# EAGLE design WeMos-meteo_v1.1 (EAGLE 9.2.2)
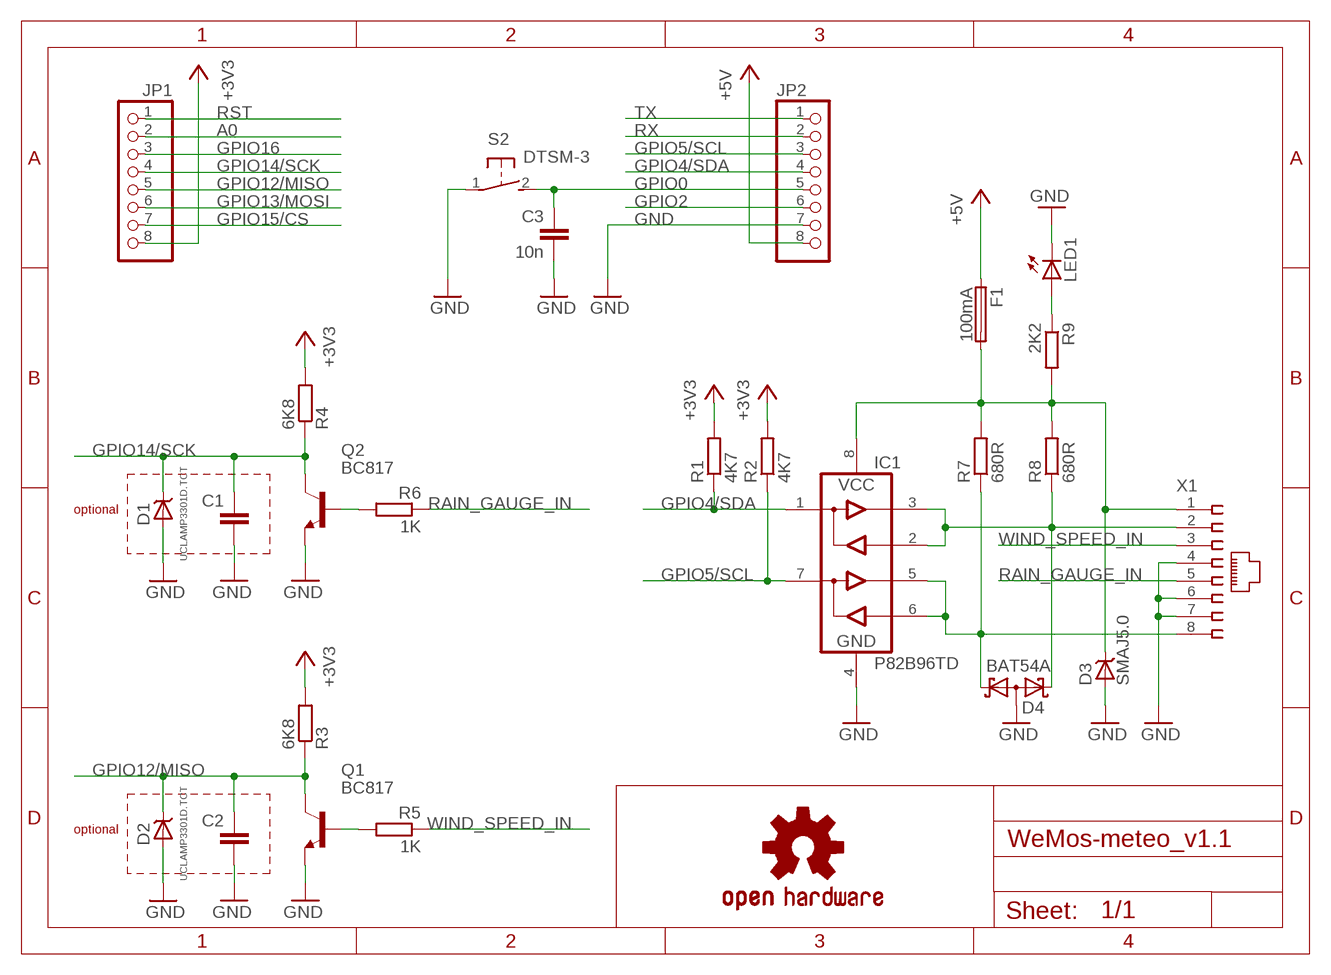
[diagram p0: schematic, sheet 1]

## Parts
C1  C-EUC0805  [C0805]
C2  C-EUC0805  [C0805]
C3  10n  C-EUC0805  [C0805]
D1  UCLAMP3301D.TCT  [SOD323]
D2  UCLAMP3301D.TCT  [SOD323]
D3  SMAJ5.0  [DO214AC]
D4  BAT54A  [SOT23]
F1  100mA  19560  [19560]
IC1  P82B96TD  [SO08]
JP1  PINHD-1X08_2.54-S  [1X08-S]
JP2  PINHD-1X08_2.54-S  [1X08-S]
LED1  LED0805  [LED0805]
LOGO1  OSHW-LOGOMINI  [OSHW-LOGO-MINI]
Q1  BC817  BC817-40SMD  [SOT23-BEC]
Q2  BC817  BC817-40SMD  [SOT23-BEC]
R1  4K7  R-EU_R0805  [R0805]
R2  4K7  R-EU_R0805  [R0805]
R3  6K8  R-EU_R0805  [R0805]
R4  6K8  R-EU_R0805  [R0805]
R5  1K  R-EU_R0805  [R0805]
R6  1K  R-EU_R0805  [R0805]
R7  680R  R-EU_R0805  [R0805]
R8  680R  R-EU_R0805  [R0805]
R9  2K2  R-EU_R0805  [R0805]
S2  DTSM-3  [DTSM-3]
X1  RJ-45  [95501]

## Nets
+3V3: JP1.8 R1.2 R2.2 R3.2 R4.2
+5V: F1.1 JP2.8
A0: JP1.2
GND: C1.2 C2.2 C3.2 D1.A D2.A D3.A D4.3(AA) IC1.4(GND) JP2.7 LED1.C Q1.E Q2.E S2.1 X1.4 X1.6 X1.7
GPIO0: C3.1 JP2.5 S2.2
GPIO2: JP2.6
GPIO4/SDA: IC1.1(SX) JP2.4 R1.1
GPIO5/SCL: IC1.7(SY) JP2.3 R2.1
GPIO12/MISO: C2.1 D2.C JP1.5 Q1.C R3.1
GPIO13/MOSI: JP1.6
GPIO14/SCK: C1.1 D1.C JP1.4 Q2.C R4.1
GPIO15/CS: JP1.7
GPIO16: JP1.3
N$1: D4.2(K2) IC1.2(RX) IC1.3(TX) R8.1 X1.2
N$2: D4.1(K1) IC1.5(TY) IC1.6(RY) R7.1 X1.8
N$3: Q1.B R5.2
N$5: Q2.B R6.2
N$6: LED1.A R9.1
RAIN_GAUGE_IN: R6.1 X1.5
RST: JP1.1
RX: JP2.2
TX: JP2.1
VCC: D3.C F1.2 IC1.8(VCC) R7.2 R8.2 R9.2 X1.1
WIND_SPEED_IN: R5.1 X1.3

## Notes on the sheet
- optional
- optional

## Library data of the parts
C1-C3 = rcl:C-EU: CAPACITOR, European symbol; SPICEPREFIX: C
D1 D2 = my-diode:UCLAMP3301?.TCT: Low Voltage μClamp TVS diode
D3 = my-diode:SM?J*: Transient Voltage Suppression Diode - TVS
D4 = diode:BAT54A: Schottky Diodes Source: Fairchild .. BAT54.pdf
F1 = my-fuses:19560: TR5 FUSE HOLDER
IC1 = my-ic:P82B96?: Dual bidirectional bus buffer
JP1 JP2 = pinhead-2:PINHD-1X08: PIN HEADER
LED1 = my-opto:LED
LOGO1 = SparkFun-Aesthetics:OSHW-LOGO: Open-Source Hardware (OSHW) Logo This logo indicates the piece of hardware it is found on incorporates a OSHW license and/or adheres to the definition of open source hardware found here: http://freedomdefined.org/OSHW
Q1 Q2 = transistor-npn:BC817*: NPN Transistor
R1-R9 = rcl:R-EU_: RESISTOR, European symbol; SPICEPREFIX: R
S2 = switch-tact:DTSM-3
X1 = my-connectors:RJ-45: RJ-45 connector

## Net classes
1 power: width 0.203 mm, clearance 0.152 mm

## Board
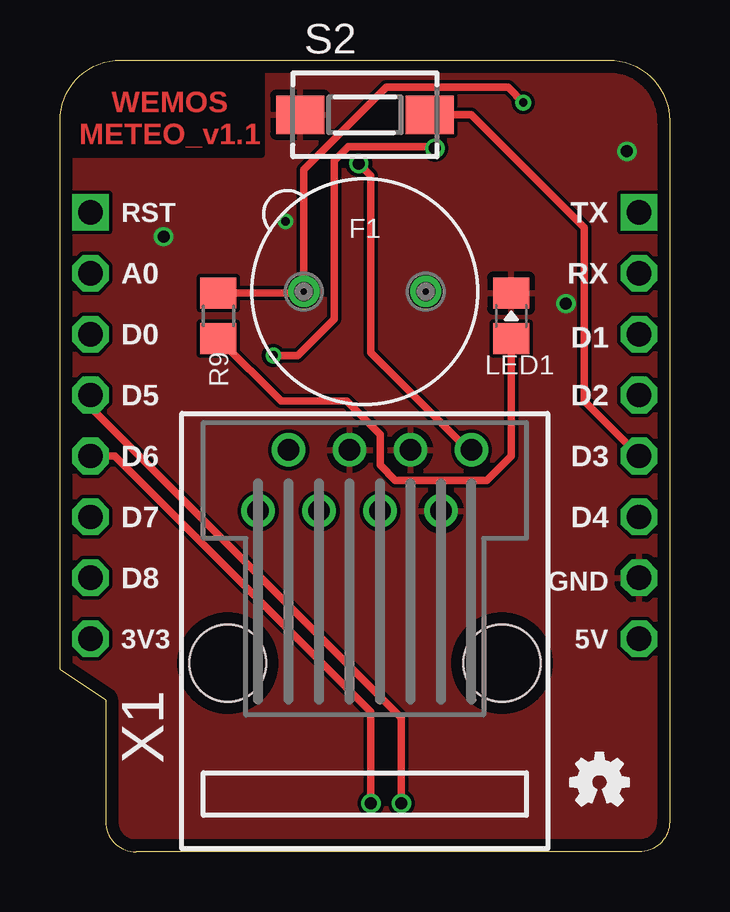
[diagram p1: board, top side]
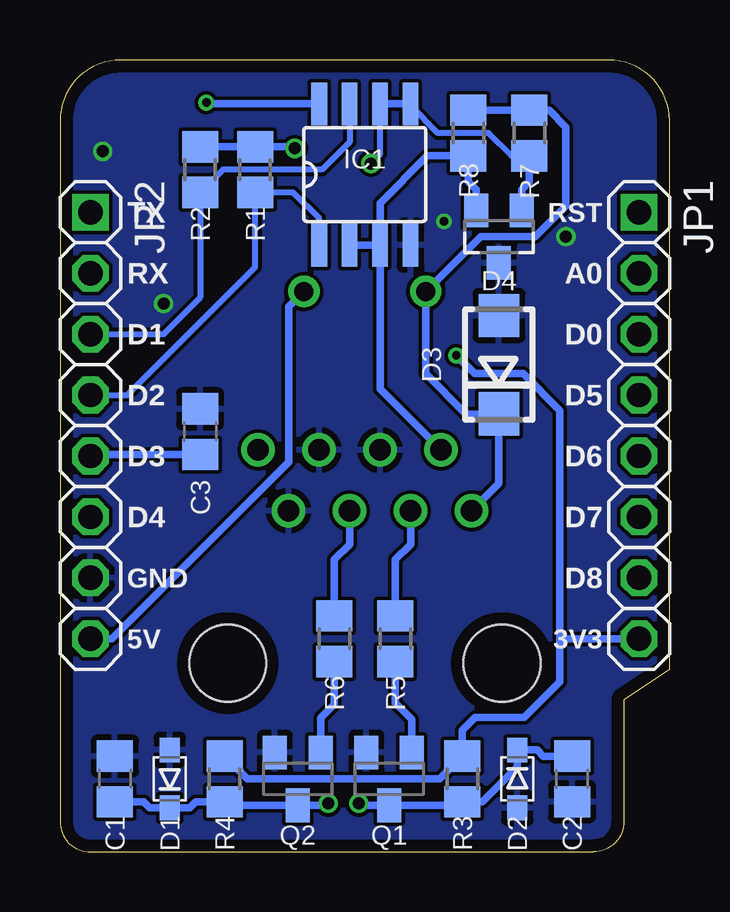
[diagram p2: board, bottom side, seen from below]

Size 25.4 x 33.02 mm. Coordinates in mm from the lower left corner, seen from the top.
Outline: 0,7.62 0,30.48 arc-90 2.54,33.02 22.86,33.02 arc-90 25.4,30.48 25.4,1.27 arc-90 24.13,0 3.17,0 arc-90 1.91,1.27 1.91,6.35 0,7.62
Copper layers (1*16): Top 0.035mm / dielectric 1.6mm / Bottom 0.035mm
Design rules "Elecrow_2-layer_PCB_eagle_rule *": minimum track width 6mil, minimum drill 12mil, track to track 6mil, track to pad 6mil, pad to pad 6mil, via to via 8mil, smd to smd 0mil, copper to edge 20mil, drill to drill 10mil, minimum pad ring 10mil, minimum via ring 6mil, stop-mask expansion 0mil, vias tented up to drill 100mil, thermal gap 10mil

### Footprints (pad centres in the part's own frame; a part is rotated, then mirrored left to right if it is on the bottom)
C0805 = smd 1.3 x 1.5: 1 -0.95,0; 2 0.95,0
SOD323 = smd 1.03 x 0.839: A 1.206,0; C -1.206,0
DO214AC = smd 1.8 x 1.7: A 2.05,0; C -2.05,0
SOT23 = smd 1 x 1.4: 1 -0.95,-1.1; 2 0.95,-1.1; 3 0,1.1
19560 = drill 0.8: 1 -2.54,0; 2 2.54,0
SO08 = smd 0.66 x 1.778: 1 -1.905,-2.946; 2 -0.635,-2.946; 3 0.635,-2.946; 4 1.905,-2.946; 5 1.905,2.946; 6 0.635,2.946; 7 -0.635,2.946; 8 -1.905,2.946
1X08-S = drill 1.016 square: 1 -8.89,0 | drill 1.016 octagon: 2 -6.35,0; 3 -3.81,0; 4 -1.27,0; 5 1.27,0; 6 3.81,0; 7 6.35,0; 8 8.89,0
LED0805 = smd 1.5 x 1.3: A 0,-0.95; C 0,0.95
SOT23-BEC = smd 1 x 1.4: B -0.95,-1.1; C 0,1.1; E 0.95,-1.1
R0805 = smd 1.3 x 1.5: 1 -0.95,0; 2 0.95,0
DTSM-3 = smd 2 x 1.6: 1 -2.7,0; 2 2.7,0
95501 = drill 0.889: 1 -4.445,6.35; 2 -3.175,8.89; 3 -1.905,6.35; 4 -0.635,8.89; 5 0.635,6.35; 6 1.905,8.89; 7 3.175,6.35; 8 4.445,8.89 | hole 3.2: -5.715,0; 5.715,0

### Placement (x,y rotation side)
C1  23.11,3.05 90 bottom
C2  4.06,3.05 270 bottom
C3  19.56,17.53 90 bottom
D1  20.83,3.05 90 bottom
D2  6.35,3.05 270 bottom
D3  7.11,20.32 90 bottom
D4  7.11,25.65 180 bottom
F1  12.7,23.37 180 top
IC1  12.7,28.24 0 bottom
JP1  1.27,17.78 270 bottom
JP2  24.13,17.78 270 bottom
LED1  18.8,22.35 0 top
LOGO1  22.48,2.92 0 top
Q1  11.68,3.05 180 bottom
Q2  15.49,3.05 180 bottom
R1  17.27,28.45 90 bottom
R2  19.56,28.45 90 bottom
R3  8.64,3.05 90 bottom
R4  18.54,3.05 90 bottom
R5  11.43,8.89 270 bottom
R6  13.97,8.89 270 bottom
R7  5.84,29.97 90 bottom
R8  8.38,29.97 90 bottom
R9  6.6,22.35 90 top
S2  12.7,30.73 0 top
X1  12.7,7.87 0 top

### Tracks (layer width: path | path; a pad name or v marks a point on that pad's centre or on a via)
+3V3  (via drill 0.35, 0.5)
  Top 0.305: v8.89,20.7 9.91,20.7 11.43,22.23 11.43,28.83 12.01,29.41 15.55,29.41 v15.62,29.34
  Bottom 0.305: R2.2 R1.2 15.68,29.4 v15.62,29.34 | R4.2 17.59,3.05 9.59,3.05 R3.2 8.64,5.08 8.1,5.61 6.05,5.61 4.57,7.09 4.57,8.89 | v8.89,20.7 8.13,19.94 6.1,19.94 4.57,18.41 4.57,8.89 | JP1.8 4.57,8.89
+5V
  Bottom 0.305: F1.1 15.88,22.73 15.88,16.26 23.24,8.89 JP2.8
GND  (via drill 0.35, 0.5)
  other vias: 23.62,29.21 4.32,25.65 21.08,22.86 9.4,26.29
  pour Top: 25.4,1.27 25.4,30.48 arc90 22.86,33.02 2.54,33.02 arc90 0,30.48 0,7.62 1.91,6.35 1.91,1.27 arc90 3.17,0 24.13,0 arc90
  pour Bottom: 25.4,1.27 25.4,30.48 arc90 22.86,33.02 2.54,33.02 arc90 0,30.48 0,7.62 1.91,6.35 1.91,1.27 arc90 3.17,0 24.13,0 arc90
GPIO0
  Top 0.305: S2.2 17.14,30.73 21.84,26.04 21.84,18.8 JP2.5
  Bottom 0.305: C3.1 24.06,16.58 JP2.5
GPIO4/SDA
  Bottom 0.254: IC1.1 14.61,26.42 15.69,27.5 R1.1 17.27,24.38 22.61,19.05 JP2.4
GPIO5/SCL
  Bottom 0.254: IC1.7 13.34,29.59 14.48,28.45 18.61,28.45 R2.1 19.56,23.11 21.08,21.59 JP2.3
GPIO12/MISO  (via drill 0.5)
  Top 0.305: v12.95,2.03 12.95,5.84 2.29,16.51 JP1.5
  Bottom 0.305: v12.95,2.03 12.87,1.95 Q1.C 8.79,1.95 R3.1 7.81,2.1 6.35,3.56 D2.C 5.52,4.25 5.27,4 C2.1
GPIO14/SCK  (via drill 0.5)
  Top 0.305: v14.22,2.03 14.22,5.59 1.27,18.54 JP1.4
  Bottom 0.305: C1.1 21.91,2.1 21.65,1.84 D1.C 20,1.84 19.75,2.1 R4.1 18.39,1.95 Q2.C 14.31,1.95 v14.22,2.03
N$1
  Bottom 0.305: X1.2 12.06,19.3 IC1.3 | IC1.3 IC1.2 | IC1.3 12.06,27.05 10.09,29.02 R8.1 8.38,27.94 8.06,27.62 D4.2
N$2  (via drill 0.5)
  Top 0.305: v12.45,28.7 12.95,28.19 12.95,20.83 17.02,16.76 X1.8
  Bottom 0.254: R7.1 6.59,29.02 7.54,29.97 9.65,29.97 10.79,31.11 IC1.5 | v12.45,28.7 12.06,29.08 IC1.6
  Bottom 0.305: IC1.5 IC1.6 | D4.1 6.16,27.62 5.84,27.94 R7.1
N$3
  Bottom 0.305: R5.2 11.43,6.22 10.73,5.53 Q1.B
N$4
  cutout Top: 8.38,32.51 1.78,32.51 arc90 0.51,31.24 0.51,29.08 8.38,29.08
N$5
  Bottom 0.305: R6.2 13.97,6.16 14.54,5.59 Q2.B
N$6
  Top 0.305: R9.1 9.21,18.8 11.94,18.8 13.34,17.4 13.34,16.13 13.97,15.49 17.78,15.49 18.8,16.51 LED1.A
RAIN_GAUGE_IN
  Bottom 0.305: X1.5 13.34,12.83 13.97,12.19 R6.1
VCC  (via drill 0.35)
  Top 0.305: R9.2 10.09,23.3 F1.2 10.16,28.45 13.59,31.88 18.67,31.88 v19.3,31.24
  Bottom 0.305: X1.1 7.11,15.37 D3.C 8.49,18.27 10.16,19.94 F1.2 7.87,25.65 5.59,25.65 4.32,26.92 4.32,30.23 5.01,30.92 R7.2 R8.2 | v19.3,31.24 19.25,31.19 IC1.8
WIND_SPEED_IN
  Bottom 0.305: X1.3 10.79,12.83 11.43,12.19 R5.1

### Text on the board
Top: WEMOS / METEO_v1.1
tPlace: RST | TX | A0 | RX | D0 | D1 | D5 | D2 | D6 | D3 | D7 | D4 | D8 | GND | 3V3 | 5V
bPlace: RST | TX | A0 | RX | D0 | D1 | D5 | D2 | D6 | D3 | D7 | D4 | D8 | GND | 3V3 | 5V